# Altium project Q42-PMP.PrjPCB (part 4 of 4)

## Sheet CONNECTIVITY.SchDoc
size A3; DocumentNumber: 1; SheetNumber: 2; SheetTotal: 2
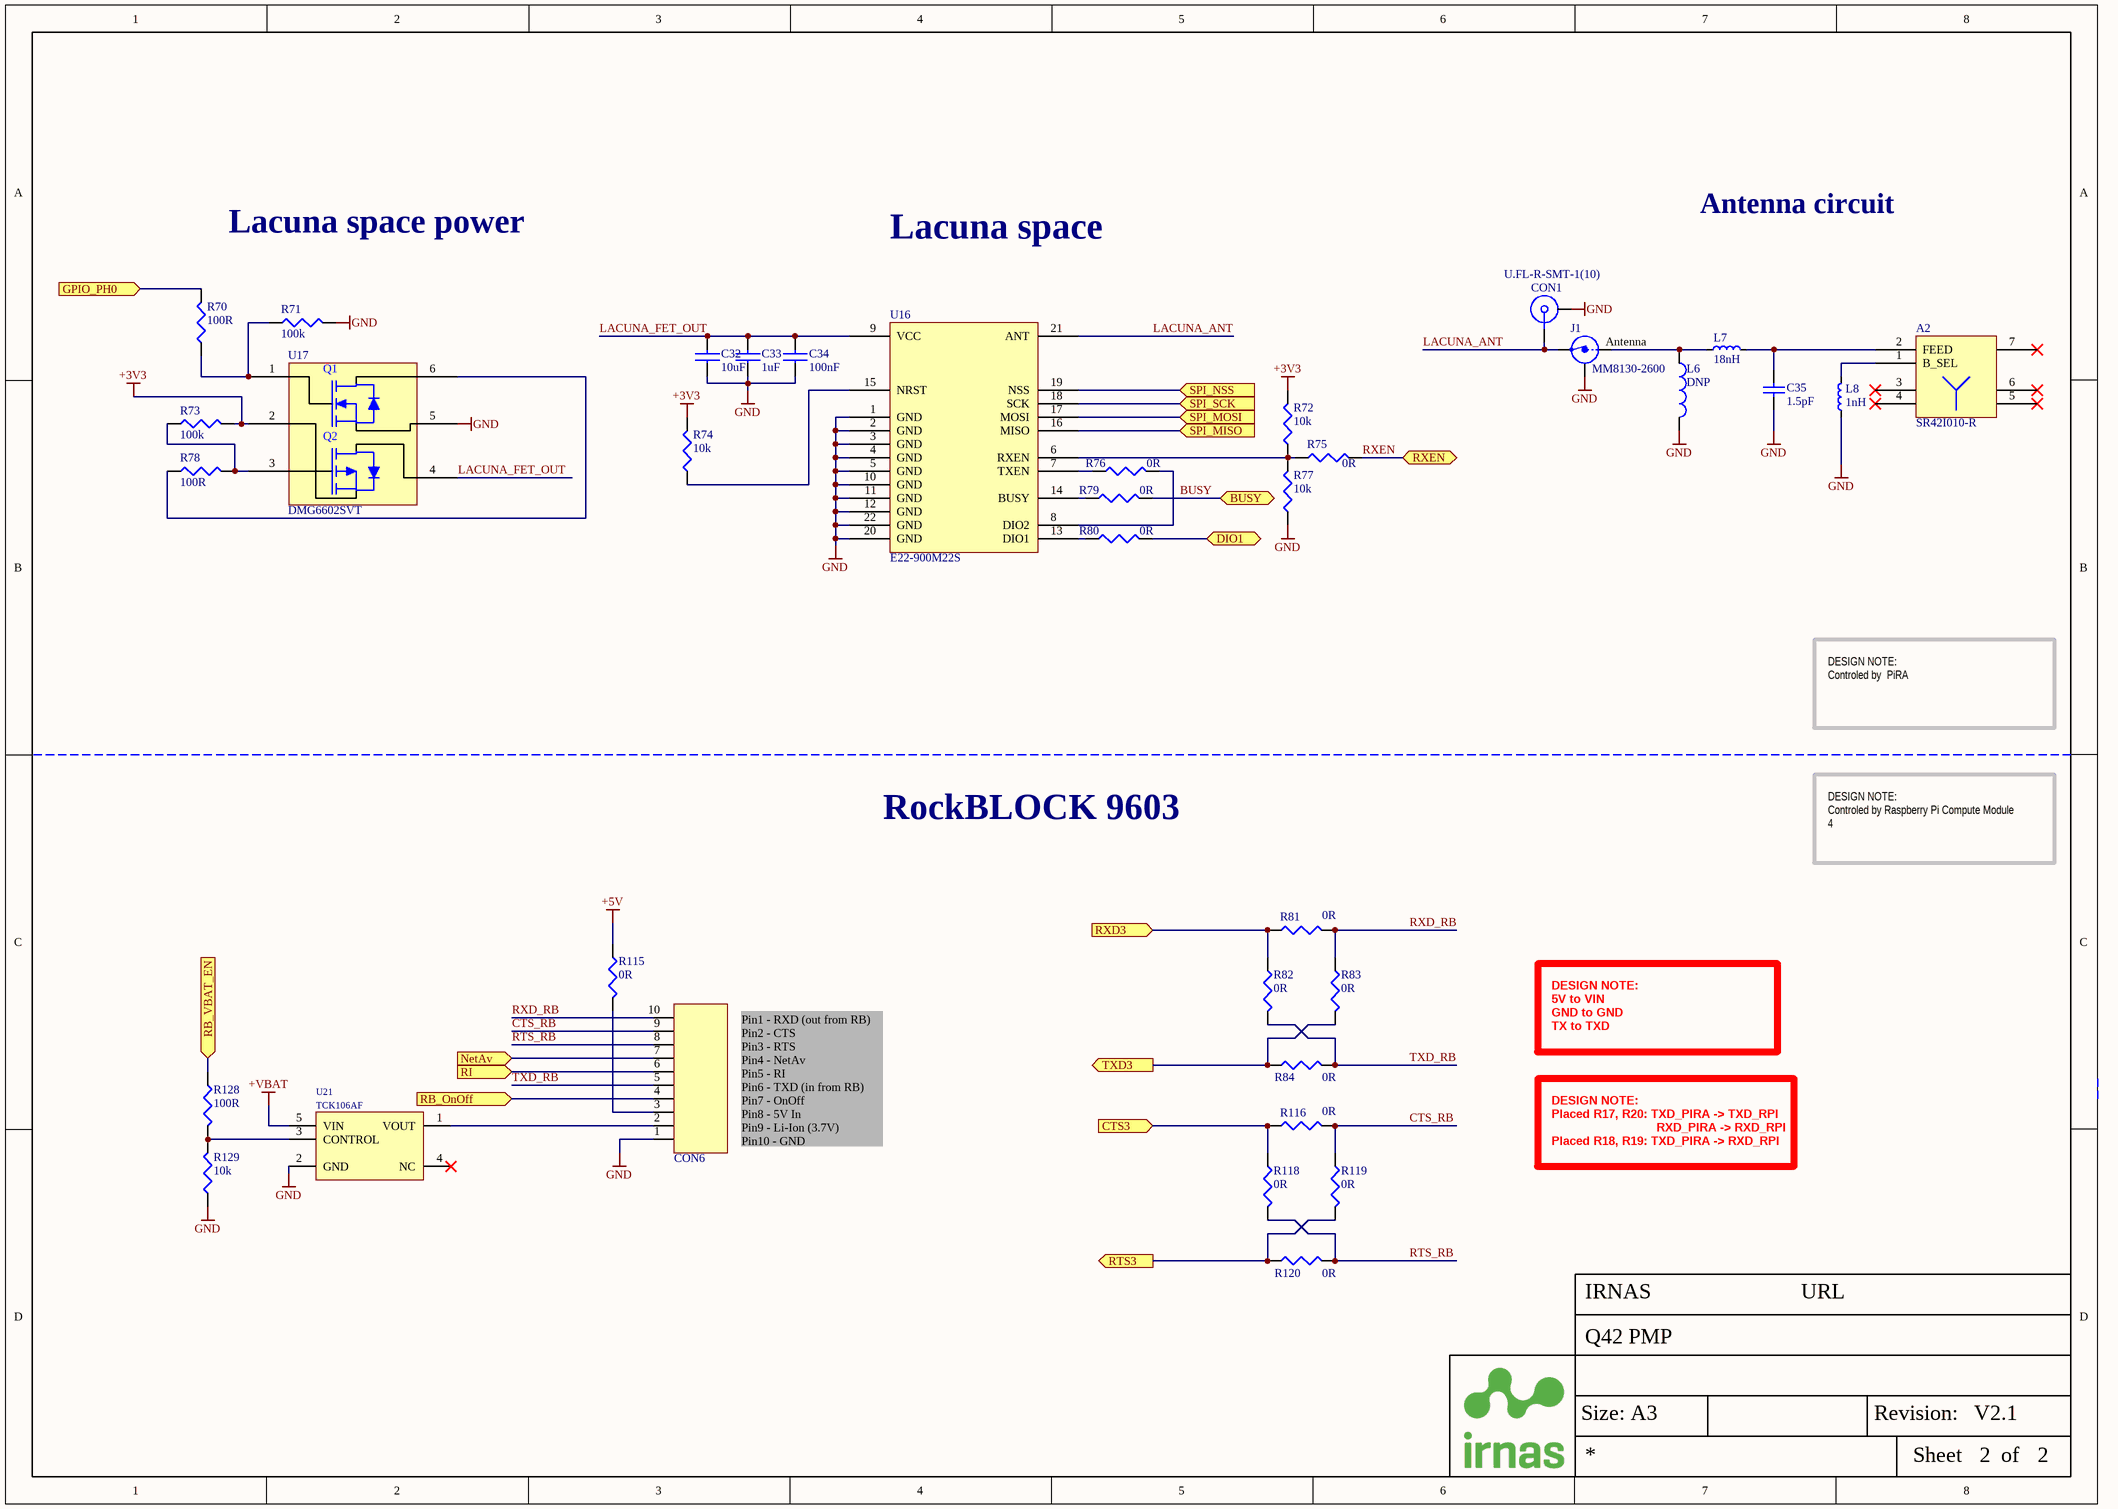
[diagram p6: CONNECTIVITY.SchDoc]

### Parts
A2  SR42I010-R  [LORA_PCB_ANTENNA]
C32  10uF  [CAP0603]
C33  1uF  [CAP0603]
C34  100nF  [CAP0603]
C35  value 1.5pF  [CAP0402]  (hidden comment: 1.5pF/50V/0402)
CON1  U.FL-R-SMT-1(10)  [ufl connector smd]
CON6  53261-1071  [PICOBLADE 10PIN]  (value not drawn)
J1  MM8130-2600  [COAXIAL-SWF]
L6  DNP  [IND0402]
L7  value 18nH  [IND0402]  (hidden comment: 18nH/0402)
L8  1nH  [IND0402]
R70  100R  [RES0603]
R71  100k  [RES0603]
R72  10k  [RES0603]
R73  100k  [RES0603]
R74  10k  [RES0603]
R75  0R  [RES0603]
R76  0R  [RES0603]
R77  10k  [RES0603]
R78  100R  [RES0603]
R79  0R  [RES0603]
R80  0R  [RES0603]
R81  0R  [RES0603]
R82  0R  [RES0603]
R83  0R  [RES0603]
R84  0R  [RES0603]
R115  0R  [RES0603]
R116  0R  [RES0603]
R118  0R  [RES0603]
R119  0R  [RES0603]
R120  0R  [RES0603]
R128  100R  [RES0603]
R129  10k  [RES0603]
U16  E22-900M22S  [E22-900M22S]
U17  DMG6602SVT  [TSOT26]
U21  TCK106AF  [SOT-25]

### Ports
BUSY (bidir), CTS3 (in), DIO1 (bidir), GPIO_PH0 (in), NetAv (in), RB_OnOff (in), RB_VBAT_EN (in), RI (in), RTS3 (out), RXD3 (in), RXEN (bidir), SPI_MISO (in), SPI_MOSI (in), SPI_NSS (in), SPI_SCK (in), TXD3 (out)

### Nets
+3V3: R72.2 R73.2 R74.2 U17.2(S2)
+5V: R115.1
+VBAT: U21.5(VIN)
GND: C32.1 C33.1 C34.1 C35.1 CON1.2 CON6.1 J1.2(Shield) L6.1 L8.1 R71.2 R77.1 R129.1 U16.1(GND) U16.2(GND) U16.3(GND) U16.4(GND) U16.5(GND) U16.10(GND) U16.11(GND) U16.12(GND) U16.20(GND) U16.22(GND) U17.5(S1) U21.2(GND)
BUSY: R79.2 ; port BUSY
CTS3: R116.1 R118.1 ; port CTS3
CTS_RB: CON6.9 R116.2 R119.1
DIO1: R80.2 ; port DIO1
GPIO_PH0: R70.2 ; port GPIO_PH0
LACUNA_ANT: CON1.1 J1.3(OUT) U16.21(ANT)
LACUNA_FET_OUT: C32.2 C33.2 C34.2 U16.9(VCC) U17.4(D2)
NetAv: CON6.7 ; port NetAv
RB_OnOff: CON6.4 ; port RB_OnOff
RB_VBAT_EN: R128.1 ; port RB_VBAT_EN
RI: CON6.6 ; port RI
RTS3: R119.2 R120.1 ; port RTS3
RTS_RB: CON6.8 R118.2 R120.2
RXD3: R81.1 R82.1 ; port RXD3
RXD_RB: CON6.10 R81.2 R83.1
RXEN: R75.2 ; port RXEN
SPI_MISO: U16.16(MISO) ; port SPI_MISO
SPI_MOSI: U16.17(MOSI) ; port SPI_MOSI
SPI_NSS: U16.19(NSS) ; port SPI_NSS
SPI_SCK: U16.18(SCK) ; port SPI_SCK
TXD3: R83.2 R84.1 ; port TXD3
TXD_RB: CON6.5 R82.2 R84.2
NetA2_1: A2.1(B_SEL) L8.2
NetA2_2: A2.2(FEED) C35.2 L7.2
NetCON6_2: CON6.2 U21.1(VOUT)
NetCON6_3: CON6.3 R115.2
NetJ1_1: J1.1(IN) L6.2 L7.1
NetR70_1: R70.1 R71.1 U17.1(G1)
NetR72_1: R72.1 R75.1 R77.2 U16.6(RXEN)
NetR73_1: R73.1 R78.2 U17.3(G2)
NetR74_1: R74.1 U16.15(NRST)
NetR76_1: R76.1 U16.7(TXEN)
NetR76_2: R76.2 U16.8(DIO2)
NetR78_1: R78.1 U17.6(D1)
NetR79_1: R79.1 U16.14(BUSY)
NetR80_1: R80.1 U16.13(DIO1)
NetR128_2: R128.2 R129.2 U21.3(CONTROL)

Not connected (* = marked no-connect by the designer): A2 3* 4* 5* 6* 7*; U21 4(NC)*

### Notes on the sheet
- Lacuna space power
- Lacuna space
- Antenna circuit
- DESIGN NOTE:
  Controled by  PiRA
- RockBLOCK 9603
- DESIGN NOTE:
  Controled by Raspberry Pi Compute Module 4
- DESIGN NOTE:
  5V to VIN
  GND to GND
  TX to TXD
  RX to RXD
- Pin1 - RXD (out from RB)
  Pin2 - CTS
  Pin3 - RTS
  Pin4 - NetAv
  Pin5 - RI
  Pin6 - TXD (in from RB)
  Pin7 - OnOff
  Pin8 - 5V In
  Pin9 - Li-Ion (3.7V)
  Pin10 - GND
- DESIGN NOTE:
  Placed R17, R20: TXD_PIRA -> TXD_RPI
  RXD_PIRA -> RXD_RPI
  Placed R18, R19: TXD_PIRA -> RXD_RPI
  RXD_PIRA -> TXD_RPI
- Size: A3
- Revision:
- Sheet
- of
- (in symbol Coaxial-Internal-SW) Antenna
- (in symbol T_M - DMG6602SVT) Q1; Q2

### Library data of the parts
A2 = ANT - SR42I010-L: Antenna SMD -4dBi Gain 870MHz/928MHz Automotive 7-Pin SMD T/R; Manufacturer: Antenova; Manufacturer Part Number: SR42I010-R; Stock 1: 3154; Pricing 1: 1 = 2.36000, 10 = 1.90000, 50 = 1.90000, 100 = 1.52000, 1000 = 1.07000, 10000 = 0.95900 (USD); Supplier 1: Mouser; Supplier Part Number 1: 237-SR42I010-L
C32 = C - 10uF/10V: Cap Ceramic 10uF 10V X5R 10% SMD 0603 85C Paper T/R; Manufacturer: Samsung; Manufacturer Part Number: CL10A106KP8NNNC; IRNAS Part No.: /; Supplier 1: Digi-Key; Stock 1: 2844657; Pricing 1: 1=0.36, 10=0.248, 100=0.1403, 500=0.099, 1000=0.08663 (USD); Mount: Surface Mount; Case/Package: 0603; Case Code (Metric): 1608; Case Code (Imperial): 0603; Material: Ceramic; Contact Plating: Tin; Min Operating Temperature: -55°C; Max Operating Temperature: 85°C; Capacitance: 10uF; Tolerance: 10%; Package Quantity: 1; Packaging: Tape and Reel; Voltage Rating: 10V; Dielectric: X5R; Voltage Rating (DC): 10V; Length: 1.6mm; Height: 0.8mm; Width: 0.031inch; Thickness: 0.035inch; Depth: 0.8mm; Radiation Hardening: No; Lead Free: Lead Free; ComponentLink1URL: https://www.verical.com/server-webapp/html/getDatasheet?partID=359551; ComponentLink1Description: https://www.verical.com/server-webapp/html/getDatasheet?partID=359551; ComponentLink2URL: http://www1.futureelectronics.com/doc/SAMSUNG%20PASSIVE/CL05B104KQ5NNNC.pdf; ComponentLink2Description: http://www1.futureelectronics.com/doc/SAMSUNG%20PASSIVE/CL05B104KQ5NNNC.pdf; ComponentLink3URL: https://produktinfo.conrad.com/datenblaetter/450000-474999/457369-da-01-en-VS_KONDENSATOR_0603.pdf; ComponentLink3Description: https://produktinfo.conrad.com/datenblaetter/450000-474999/457369-da-01-en-VS_KONDENSATOR_0603.pdf; Supplier Part Number 1: 1276-1192-1-ND
C33 = C - 1uF: as C26 on sheet PIRA BLE, LORA, RTC; Supplier 1: Farnell; Manufacturer: MURATA; Manufacturer Part Number: GRM188R61H105KAALD; RoHS: YES; Stock 1: 62682; Pricing 1: 10=0.093, 100=0.062, 500=0.0507, 1000=0.0465, 2000=0.0429, 4000=0.0399, 20000=0.0372, 40000=0.0365 (GBP); Packaging: Cut Tape; Operating Temperature Min: -55; Operating Temperature Max: 85; Automotive Qualification Standard: -; MSL: -; Capacitance Tolerance ±: ± 10%; ComponentLink1URL: http://www.farnell.com/datasheets/2048611.pdf; ComponentLink1Description: http://www.farnell.com/datasheets/2048611.pdf; Supplier Part Number 1: 1845736
C34 = C - 100nF: as C28 on sheet USB SWITCH; Supplier 1: Farnell; Manufacturer: MURATA; Manufacturer Part Number: GRM188R71C104KA01J; RoHS: YES; Stock 1: 18297; Pricing 1: 10=0.0145, 100=0.0126, 500=0.0081, 2500=0.0059, 5000=0.0052, 10000=0.0046, 50000=0.0036, 100000=0.0035 (GBP); Packaging: Cut Tape; Operating Temperature Min: -55; Operating Temperature Max: 125; Automotive Qualification Standard: -; MSL: MSL 1 - Unlimited; ComponentLink1URL: http://www.farnell.com/datasheets/2189124.pdf; ComponentLink1Description: http://www.farnell.com/datasheets/2189124.pdf; Supplier Part Number 1: 2688519
C35 = C - 1.5pF/50V/0402: CAP CER 1.5PF 50V C0G/NP0 0402; Published: 8-Jun-2000; LatestRevisionDate: 05-oct-2007  -  Semtech; LatestRevisionNote: Re-released for DXP Platform.; Publisher: Altium Limited; Supplier 1: Digi-Key; Supplier Part Number 1: 490-6212-1-ND
CON1 = U.FL-R-SMT-1(10): RF / Coaxial Connector, U.FL Coaxial, Straight Jack, Surface Mount Vertical, 50 ohm, Brass; Manufacturer: Hirose; Featured Product: U.FL Series Connectors; Connector Style: U.FL, Ultra Miniature Coaxial; Connector Type: Receptacle, Male Pin; Contact Termination: Solder; Impedance: 50 Ohm; Frequency - Max: 6GHz; Body Material: Phosphor Bronze; Body Finish: Silver; Center Contact Plating: Gold; Dielectric Material: Liquid Crystal Polymer (LCP); Online Catalog: UMCC (Ultra Miniature Coax Connectors), U.FL Series; Other Names: H11891TR  Q5400621  U.FL-R-SMT-1 10  U.FL-R-SMT-1(10)-ND  UFLRSMT110; Supplier 1: Farnell; Manufacturer Part Number: U.FL-R-SMT-1(10); Stock 1: 0; Standard Package: 2,500; Category: Connectors, Interconnects; Family: Coaxial Connectors (RF); Series: U.FL; Packaging: Tape & Reel (TR); Shield Termination: Solder; Mounting Type: Surface Mount; Cable Group: -; Fastening Type: Snap-On; Features: -; Housing Color: Beige; Ingress Protection: -; Center Contact Material: Brass; Voltage Rating: -; Operating Temperature: -40°C ~ 90°C; ComponentLink1URL: http://www.farnell.com/datasheets/91524.pdf; ComponentLink1Description: http://www.farnell.com/datasheets/91524.pdf; ComponentLink2URL: http://uk.rs-online.com/webdocs/1363/0900766b81363563.pdf; ComponentLink2Description: http://uk.rs-online.com/webdocs/1363/0900766b81363563.pdf; ComponentLink3URL: http://www.farnell.com/datasheets/1947917.pdf; ComponentLink3Description: http://www.farnell.com/datasheets/1947917.pdf; Supplier Part Number 1: 1688077
CON6 = PicoBlade 10pin: Wire-To-Board Connector, Right Angle, 1.25 mm, 10 Contacts, Header, PicoBlade 53261 Series; ComponentLink1Description: Datasheet; ComponentLink1URL: http://www.farnell.com/datasheets/2697773.pdf?_ga=2.235245378.2144023421.1568612611-1741076818.1563951383; Supplier 1: Farnell; Supplier Part Number 1: 1125377
J1 = Coaxial-Internal-SW: Coaxial Connector with Switch; Manufacturer: Murata; 2nd source part number: 81-MM8130-2600RA2; Artikkelnr Noca: 55029011; Artikkelnr Simpro: N.A.; Part Number: MM8130-2600; Manufacturer Part Number: MM8130-2600; Datasheet: http://www.murata.com/products/catalog/pdf/o33e.pdf; LatestRevisionDate: 2014-04-24; Pin Count: 3; Publisher: Nordic Semiconductor; Published: 2014-04-24; Value: MM8130-2600; Note: *; Supplier: Digi-Key; Supplier part number: 490-4981-1-ND; 2nd source Supplier: Mouser; Footprint Doc: COAXIAL-SWF
L6 = L - 4.3nH/0402: Inductor RF Chip Multi-Layer 4.3nH 0.3nH 100MHz 8Q-Factor Air 300mA 210mOhm DCR 0402 Paper T/R; Manufacturer: Murata; Manufacturer Part Number: LQG15HN4N3S02D; IRNAS Part No.: /; Q Factor: 8; Self Resonant Frequency: 6GHz; Shielding: Unshielded; DC Resistance (DCR): 210mR; Supplier 1: Digi-Key; Stock 1: 3502; Pricing 1: 1 = 0.10000, 10 = 0.06100, 100 = 0.04040, 500 = 0.03366, 1000 = 0.02827, 2500 = 0.02423 (USD); RoHS: Yes; Mount: Surface Mount; Case/Package: 0402; Core Material: Air; Case Code (Metric): 1005; Case Code (Imperial): 0402; Min Operating Temperature: -55°C; Max Operating Temperature: 125°C; Package Quantity: 10000; Packaging: Tape and Reel; Current Rating: 300mA; Inductance: 4.3nh; Test Frequency: 100MHz; Max DC Current: 300mA; Termination: SMD/SMT; Current: 300mA; DC Current: 300mA; Military Standard: Not; Length: 1.05mm; Height: 0.5mm; Width: 0.02inch; Height - Seated (Max): 0.022inch; Depth: 0.55mm; Radiation Hardening: No; REACH SVHC: No SVHC; Lead Free: Lead Free; ComponentLink1URL: http://uk.rs-online.com/webdocs/0f10/0900766b80f10808.pdf?src-supplier=RSComponents; ComponentLink1Description: http://uk.rs-online.com/webdocs/0f10/0900766b80f10808.pdf?src-supplier=RSComponents; ComponentLink2URL: http://search.murata.co.jp/Ceramy/image/img/PDF/ENG/L0075S0083LQG15HN.pdf?src-supplier=Avnet; ComponentLink2Description: http://search.murata.co.jp/Ceramy/image/img/PDF/ENG/L0075S0083LQG15HN.pdf?src-supplier=Avnet; ComponentLink3URL: http://www.farnell.com/datasheets/66026.pdf?src-supplier=Element14; ComponentLink3Description: http://www.farnell.com/datasheets/66026.pdf?src-supplier=Element14; ComponentLink4URL: https://www.verical.com/server-webapp/html/getDatasheet?partID=31252&src-supplier=Verical; ComponentLink4Description: https://www.verical.com/server-webapp/html/getDatasheet?partID=31252&src-supplier=Verical; ComponentLink5URL: http://search.murata.co.jp/Ceramy/image/img/PDF/ENG/L0075S0083LQG15HN.pdf?src-supplier=Avnet+Europe; ComponentLink5Description: http://search.murata.co.jp/Ceramy/image/img/PDF/ENG/L0075S0083LQG15HN.pdf?src-supplier=Avnet+Europe; ComponentLink6URL: https://search.murata.co.jp/Ceramy/image/img/P02/partnumberingAT_LQ3E.pdf?src-supplier=Digi-Key; ComponentLink6Description: https://search.murata.co.jp/Ceramy/image/img/P02/partnumberingAT_LQ3E.pdf?src-supplier=Digi-Key; Supplier Part Number 1: 490-6563-1-ND
L7 = L - 18nH/230mA/0402: 18 nH, 0.8 ohm, 2.3 GHz, 260 mA, 0402; Manufacturer: MURATA; Manufacturer Part Number: LQG15WH18NJ02D; Code_IEC: 1005; Published: 8-Jun-2000; LatestRevisionDate: 05-oct-2007  -  Semtech; LatestRevisionNote: Re-released for DXP Platform.; Publisher: Altium Limited; Code_JEITA: 0402; Supplier 1: Farnell; Supplier Part Number 1: 3263541
L8 = L - 1nH/0402: Multilayer Inductor, 1 nH, 0.07 ohm, 10 GHz, 1 A, 0402 [1005 Metric], LQG15HS_02 Series; Supplier 1: Farnell; Supplier Part Number 1: 3471230
R70 R78 R128 = R - 100R: as R25 on sheet PIRA BLE, LORA, RTC; Supplier 1: Farnell; Manufacturer: MULTICOMP; Manufacturer Part Number: MC0063W06031100R; RoHS: Y-EX; Stock 1: 78152; Pricing 1: 10=0.0011, 100=0.001, 500=0.0009, 1000=0.0008, 2500=0.0007 (GBP); Resistance Tolerance: ± 1%; Packaging: Cut Tape; Resistor Element Material: Thick Film; Automotive Qualification Standard: -; Operating Temperature Max: 155; Operating Temperature Min: -55; Operating Temperature Range: -55°C to +155; Tape Width: 8; Temperature Coeff. -: 200; Tolerance +: 1%; Tolerance -: 1%; ComponentLink1URL: http://www.farnell.com/datasheets/1788326.pdf; ComponentLink1Description: http://www.farnell.com/datasheets/1788326.pdf; ComponentLink2URL: http://www.farnell.com/cad/1561149.zip; ComponentLink2Description: http://www.farnell.com/cad/1561149.zip; ComponentLink3URL: http://www.farnell.com/datasheets/2289252.pdf; ComponentLink3Description: http://www.farnell.com/datasheets/2289252.pdf; Supplier Part Number 1: 9330364
R71 R73 = R - 100k: MULTICOMP - MCMR06X104 JTL - RES, CERAMIC, 100K, 5%, 0.1W, 0603; IRNAS Part No.: I-100007; Resistance: 100; Voltage Rating: 75; Resistor Case Style: 0603 [1608 Metric]; Product Range: MCMR Series; Temperature Coefficient: ± 100; Resistor Mounting: Surface Mount Device<!--FANDB--><div class="features-and-benefits-container"><div class="features-and-benefits-description"><span class="features-benefits-value">The Multicomp MCMR series resistors are automotive grade, anti sulphured thick film chip resistor. The resistance range includes E24 and E96 decade values from 1ohm to 10Mohm. These resistors are constructed on top of a high grade ceramic body.</span></div><div class="features-and-benefits-list"><ul class="features-and-benefits-list-list"><li class="features-and-benefits-list-item">EIA 0402, 0603, 0805, 1206 chip sizes available</li><li class="features-and-benefits-list-item">High reliability and stability</li><li class="features-and-benefits-list-item">Automotive grade AEC-Q200 compliant</li><li class="features-and-benefits-list-item">Complaint with (IEC 60068-1) 55/155/56 climatic category</li><li class="features-and-benefits-list-item">Maximum operation voltage of 50V, 75V, 150V and 200V</li><li class="features-and-benefits-list-item">Power rating of 62.5mW, 100mW, 125mW and 250mW</li><li class="features-and-benefits-list-item">Available in ±1% and ±5% tolerance</li><li class="features-and-benefits-list-item">Temperature coefficient (TCR) of +200ppm/°C, +100ppm/°C and -200ppm/°C to +400ppm/°C</li><li class="features-and-benefits-list-item">Operating temperature range -55°C to 155; Supplier 1: Farnell; Manufacturer: MULTICOMP; Manufacturer Part Number: MCMR06X104 JTL; RoHS: Y-EX; Stock 1: 187; Pricing 1: 10=0.0109, 100=0.0085, 500=0.006, 1000=0.0048, 2500=0.004, 5000=0.003, 25000=0.002, 50000=0.0016 (GBP); Power Rating: 100; Resistance Tolerance: ± 5%; Packaging: Cut Tape; Resistor Element Material: Ceramic; Automotive Qualification Standard: -; ComponentLink1URL: http://www.farnell.com/datasheets/1716707.pdf; ComponentLink1Description: http://www.farnell.com/datasheets/1716707.pdf; Supplier Part Number 1: 2073357
R72 R74 R77 R129 = R - 10k: as R30 on sheet PIRA BLE, LORA, RTC; Supplier 1: Farnell; Manufacturer: MULTICOMP; Manufacturer Part Number: MCMR06X103 JTL; RoHS: Y-EX; Stock 1: 19791; Pricing 1: 10=0.0087, 100=0.0074, 500=0.0061, 1000=0.0048, 2500=0.0032, 5000=0.0024, 25000=0.0016, 50000=0.0013 (GBP); Resistance Tolerance: ± 5%; Packaging: Cut Tape; Resistor Element Material: Ceramic; ComponentLink1URL: http://www.farnell.com/datasheets/1716707.pdf; ComponentLink1Description: http://www.farnell.com/datasheets/1716707.pdf; Supplier Part Number 1: 2073356
R75 R76 R79-R84 R115 R116 R118-R120 = R - 0R: as R117 on sheet USB SWITCH; Supplier 1: Farnell; Manufacturer: BOURNS; Manufacturer Part Number: CR0603-J/-000ELF; RoHS: YES; Stock 1: 58200; Pricing 1: 10=0.0146, 250=0.0097, 1000=0.0073, 5000=0.0049, 12500=0.0042 (GBP); Resistance Tolerance: ± 5%; Packaging: Cut Tape; Resistor Element Material: Thick Film; Temperature Coefficient: -; Automotive Qualification Standard: -; MSL: MSL 1 - Unlimited; ComponentLink1URL: http://www.bourns.com/engineering/CHPREZTR/cr0603.stp; ComponentLink1Description: http://www.bourns.com/engineering/CHPREZTR/cr0603.stp; ComponentLink2URL: http://www.farnell.com/datasheets/2178762.pdf; ComponentLink2Description: http://www.farnell.com/datasheets/2178762.pdf; Supplier Part Number 1: 2008343
U16 = RF - E22-900M22S: ComponentLink1Description: Datasheet; ComponentLink1URL: http://www.ebyte.com/en/downpdf.aspx?id=437
U17 = T_M - DMG6602SVT: Dual MOSFET, N and P Channel, 3.4 A, 30 V, 0.038 ohm, 10 V, 1 V; ComponentLink1Description: Datasheet; ComponentLink1URL: http://www.farnell.com/datasheets/1915929.pdf?_ga=2.95290844.1984085946.1565589483-1741076818.1563951383; Supplier 1: Farnell; Supplier Part Number 1: 2061522
U21 = SW - TCK106AF: 1.0 A Load Switch IC; Opis / Description: TCK106AF; Value: TCK106AF; Supplier 1: Digi-Key; Supplier Part Number 1: TCK106AFLFCT-ND

## Sheet IFREMER ADD ON.SchDoc
size A3; DocumentNumber: 1; SheetNumber: 2; SheetTotal: 2
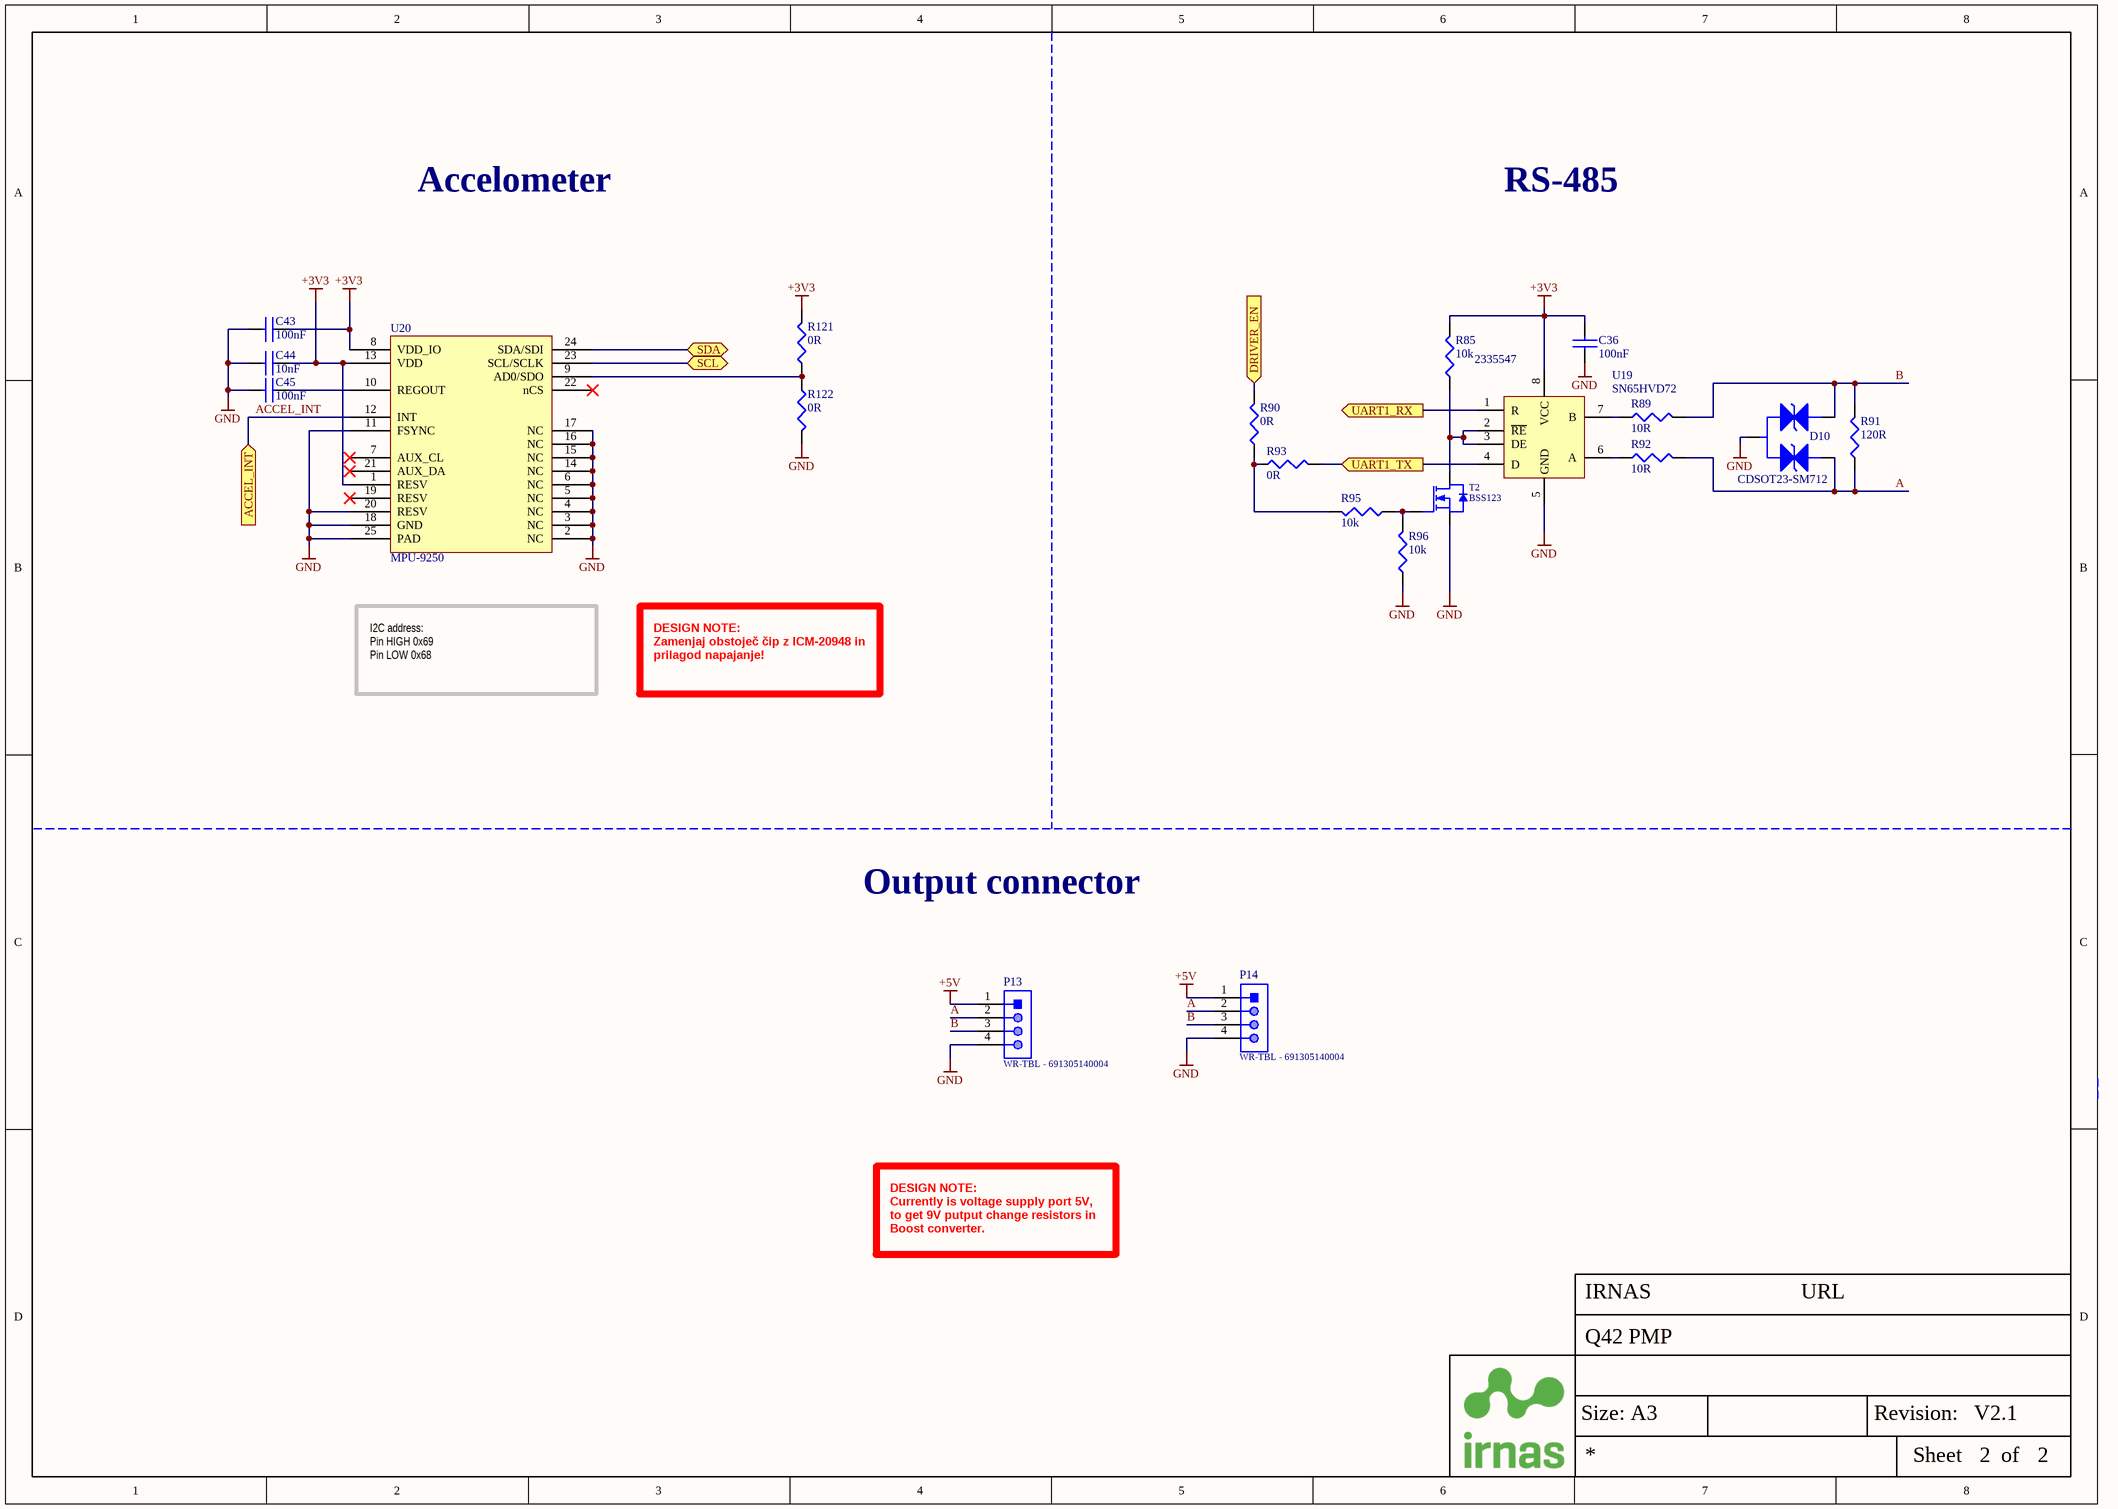
[diagram p7: IFREMER ADD ON.SchDoc]

### Parts
C36  100nF  [CAP0603]
C43  100nF  [CAP0603]
C44  10nF  [CAP0603]
C45  100nF  [CAP0603]
D10  CDSOT23-SM712  [SOT23-3AL]
P13  WR-TBL - 691305140004  [691305140004]
P14  WR-TBL - 691305140004  [691305140004]
R85  10k  [RES0603]
R89  10R  [RES0603]
R90  0R  [RES0603]
R91  120R  [RES0603]
R92  10R  [RES0603]
R93  0R  [RES0603]
R95  10k  [RES0603]
R96  10k  [RES0603]
R121  0R  [RES0603]
R122  0R  [RES0603]
T2  BSS123  [SOT23-3AL]
U19  SN65HVD72  Supplier Part Number 1: 2335547  [SOIC-8 REFLOW]
U20  MPU-9250  [QFN40P300X300X105_HS-25N]

### Ports
ACCEL_INT (in), DRIVER_EN (in), SCL (bidir), SDA (bidir), UART1_RX (out), UART1_TX (in)

### Nets
+3V3: C36.2 C43.1 C44.1 R85.2 R121.2 U19.8(VCC) U20.1(RESV) U20.8(VDD_IO) U20.13(VDD)
+5V: P13.1 P14.1
GND: C36.1 C43.2 C44.2 C45.2 D10.3(ANODE) P13.4 P14.4 R96.1 R122.2 T2.2(S) U19.5(GND) U20.2(NC) U20.3(NC) U20.4(NC) U20.5(NC) U20.6(NC) U20.11(FSYNC) U20.14(NC) U20.15(NC) U20.16(NC) U20.17(NC) U20.18(GND) U20.20(RESV) U20.25(PAD)
A: D10.2(cathode) P13.2 P14.2 R91.1 R92.2
ACCEL_INT: U20.12(INT) ; port ACCEL_INT
B: D10.1(cathode) P13.3 P14.3 R89.2 R91.2
DRIVER_EN: R90.2 ; port DRIVER_EN
GPS_RX: R93.2 U19.4(D) ; port UART1_TX
GPS_TX: U19.1(R) ; port UART1_RX
SCL: U20.23(SCL/SCLK) ; port SCL
SDA: U20.24(SDA/SDI) ; port SDA
NetC45_1: C45.1 U20.10(REGOUT)
NetR85_1: R85.1 T2.3(D) U19.2(~{RE}) U19.3(DE)
NetR89_1: R89.1 U19.7(B)
NetR90_1: R90.1 R93.1 R95.2
NetR92_1: R92.1 U19.6(A)
NetR95_1: R95.1 R96.2 T2.1(G)
NetR121_1: R121.1 R122.1 U20.9(AD0/SDO)

Not connected (* = marked no-connect by the designer): U20 7(AUX_CL)* 19(RESV)* 21(AUX_DA)* 22(nCS)*

### Notes on the sheet
- Accelometer
- RS-485
- I2C address:
  Pin HIGH 0x69
  Pin LOW 0x68
- DESIGN NOTE:
  Zamenjaj obstoječ čip z ICM-20948 in prilagod napajanje!
- Output connector
- DESIGN NOTE:
  Currently is voltage supply port 5V, to get 9V putput change resistors in Boost converter.
- Size: A3
- Revision:
- Sheet
- of

### Library data of the parts
C36 C43 C45 = C - 100nF: as C28 on sheet USB SWITCH; Supplier 1: Farnell; Manufacturer: MURATA; Manufacturer Part Number: GRM188R71C104KA01J; RoHS: YES; Stock 1: 18297; Pricing 1: 10=0.0145, 100=0.0126, 500=0.0081, 2500=0.0059, 5000=0.0052, 10000=0.0046, 50000=0.0036, 100000=0.0035 (GBP); Packaging: Cut Tape; Operating Temperature Min: -55; Operating Temperature Max: 125; Automotive Qualification Standard: -; MSL: MSL 1 - Unlimited; ComponentLink1URL: http://www.farnell.com/datasheets/2189124.pdf; ComponentLink1Description: http://www.farnell.com/datasheets/2189124.pdf; Supplier Part Number 1: 2688519
C44 = C - 10nF: KEMET - C0603X103K5RECAUTO - CAP, MLCC, AEC-Q200, X7R, 0.01UF, 50V; Manufacturer: TDK EPCOS; IRNAS Part No.: I-200004; Supplier 1: Farnell; Manufacturer Part Number: C0603X103K5RECAUTO; Stock 1: 307350; Pricing 1: 10=0.133, 100=0.0731, 500=0.055, 1000=0.0465, 2000=0.0408, 4000=0.0336, 20000=0.0295 (GBP); ComponentLink1URL: http://www.farnell.com/datasheets/2290180.pdf; ComponentLink1Description: http://www.farnell.com/datasheets/2290180.pdf; Supplier Part Number 1: 2760492
D10 = D_TVS - CDSOT23-SM712: TVS Diode, CDSOT23 Series, Bidirectional, 12 V, 26 V, SOT-23, 3 Pins; Manufacturer: DIODES INC.; Manufacturer Part Number: 1N4148W-7-F.; Diode Configuration: Single; Repetitive Reverse Voltage Vrrm Max: 100; Forward Current If(AV): 300; Forward Voltage VF Max: 1.25; Reverse Recovery Time trr Max: 4; Forward Surge Current Ifsm Max: 2; Diode Case Style: SOD-123; Product Range: 1N4148 Series; SVHC: No SVHC (17-Dec-2015); Diode Type: Switching; Supplier 1: Farnell; RoHS: YES; Stock 1: 157320; Pricing 1: 1=0.136, 25=0.132, 100=0.0465, 500=0.042, 1000=0.024, 3000=0.021, 9000=0.017, 30000=0.0149 (GBP); Operating Temperature Max: 150; No. of Pins: 2; Packaging: Cut Tape; Automotive Qualification Standard: -; MSL: MSL 1 - Unlimited; Operating Temperature Min: -65; Operating Temperature Range: -65°C to +150°C<!--FANDB--><div class="features-and-benefits-container"><div class="features-and-benefits-description"><span class="features-benefits-value">The 1N4148W-7-F is a surface mount fast Switching Diode with moulded plastic case. Suitable for general purpose switching applications.</span></div><div class="features-and-benefits-list"><ul class="features-and-benefits-list-list"><li class="features-and-benefits-list-item">Fast Switching Speed</li><li class="features-and-benefits-list-item">2; ComponentLink1URL: http://www.farnell.com/datasheets/2238378.pdf; ComponentLink1Description: http://www.farnell.com/datasheets/2238378.pdf; Supplier Part Number 1: 1776392
P13 P14 = WR-TBL - 691305140004: Serie 3051 - 3.50mm Horizontal PCB Header with Plastic Latch WR-TBL, 4 pin; Pin Number: 4; Gender: Male; ComponentLink1Description: Manufacturer; ComponentLink1URL: http://www.we-online.de; ComponentLink2Description: Datasheet; ComponentLink2URL: http://katalog.we-online.de/em/datasheet/691305140004.pdf; Part Number: 691305140004; Published Date: June 2018; Publisher: Wurth Elektronik; Pitch: 3.50 mm; Operating Temperature: -40 to 105 degC; Mounting Technology: THT; Packaging: Box
R85 R95 R96 = R - 10k: as R30 on sheet PIRA BLE, LORA, RTC; Supplier 1: Farnell; Manufacturer: MULTICOMP; Manufacturer Part Number: MCMR06X103 JTL; RoHS: Y-EX; Stock 1: 19791; Pricing 1: 10=0.0087, 100=0.0074, 500=0.0061, 1000=0.0048, 2500=0.0032, 5000=0.0024, 25000=0.0016, 50000=0.0013 (GBP); Resistance Tolerance: ± 5%; Packaging: Cut Tape; Resistor Element Material: Ceramic; ComponentLink1URL: http://www.farnell.com/datasheets/1716707.pdf; ComponentLink1Description: http://www.farnell.com/datasheets/1716707.pdf; Supplier Part Number 1: 2073356
R89 R92 = R - 10R: as R56 on sheet USB SWITCH; Supplier 1: Farnell; Manufacturer: VISHAY; Manufacturer Part Number: RCA060310R0FKEA; RoHS: YES; Stock 1: 9559; Pricing 1: 10=0.0803, 100=0.0386, 500=0.0235, 2500=0.015, 5000=0.0135, 10000=0.0108, 50000=0.0068, 100000=0.0067 (GBP); Resistance Tolerance: ± 1%; Packaging: Cut Tape; Resistor Element Material: Thick Film; ComponentLink1URL: http://www.farnell.com/datasheets/2111201.pdf; ComponentLink1Description: http://www.farnell.com/datasheets/2111201.pdf; Supplier Part Number 1: 2616585
R90 R93 R121 R122 = R - 0R: as R117 on sheet USB SWITCH; Supplier 1: Farnell; Manufacturer: BOURNS; Manufacturer Part Number: CR0603-J/-000ELF; RoHS: YES; Stock 1: 58200; Pricing 1: 10=0.0146, 250=0.0097, 1000=0.0073, 5000=0.0049, 12500=0.0042 (GBP); Resistance Tolerance: ± 5%; Packaging: Cut Tape; Resistor Element Material: Thick Film; Temperature Coefficient: -; Automotive Qualification Standard: -; MSL: MSL 1 - Unlimited; ComponentLink1URL: http://www.bourns.com/engineering/CHPREZTR/cr0603.stp; ComponentLink1Description: http://www.bourns.com/engineering/CHPREZTR/cr0603.stp; ComponentLink2URL: http://www.farnell.com/datasheets/2178762.pdf; ComponentLink2Description: http://www.farnell.com/datasheets/2178762.pdf; Supplier Part Number 1: 2008343
R91 = R - 120R: RES SMD 120 OHM 1% 1/4W 0603; Manufacturer: Vishay; Manufacturer Part Number: CRCW0603120RFKEAHP; Voltage Rating: 75V; Power Rating: 250mW; Temperature Coefficient: 100ppm/°C; Supplier 1: Farnell; Stock 1: 34760; Pricing 1: 10=0.141, 100=0.0937, 500=0.0669, 1000=0.0453 (EUR); Case/Package: 0603; Contact Plating: Tin; Case Code (Metric): 1608; Case Code (Imperial): 0603; Min Operating Temperature: -55°C; Max Operating Temperature: 155°C; Package Quantity: 5000; Packaging: Tape and Reel; Termination: SMD/SMT; Resistance: 120R; Tolerance: 1%; Composition: Thick Film; Number of Terminations: 2; Military Standard: Not; Max Power Dissipation: 250mW; Features: Automotive AEC-Q200; Length: 1.6mm; Height: 0.022inch; Width: 0.033inch; Depth: 0.85mm; Radiation Hardening: No; REACH SVHC: Unknown; ComponentLink1URL: https://datasheet.ciiva.com/5852/424479-5852064.pdf; ComponentLink1Description: https://datasheet.ciiva.com/5852/424479-5852064.pdf; ComponentLink2URL: https://datasheet.ciiva.com/2578/crcwhpe3-2578529.pdf; ComponentLink2Description: https://datasheet.ciiva.com/2578/crcwhpe3-2578529.pdf; ComponentLink3URL: https://datasheet.ciiva.com/8975/crcwhpe3-8975275.pdf; ComponentLink3Description: https://datasheet.ciiva.com/8975/crcwhpe3-8975275.pdf; ComponentLink4URL: https://datasheet.ciiva.com/7777/424479-7777277.pdf; ComponentLink4Description: https://datasheet.ciiva.com/7777/424479-7777277.pdf; ComponentLink5URL: https://datasheet.ciiva.com/7777/424479-7777278.pdf; ComponentLink5Description: https://datasheet.ciiva.com/7777/424479-7777278.pdf; Supplier Part Number 1: 1738892
T2 = T_M - BSS123: N-Channel Vds = 100V, Id = 170 mA; Opis / Description: MOSFET BSS123       /N-Channel; Komp / Device: SMD; Value: BSS128W; Velikost / Size: SOT23; ComponentLink1Description: Datasheet; ComponentLink1URL: C:\ELRADSVN\Altium_Library\Libraries\Active\Datasheet\BSS138BKW.pdf; Date: 11.07.2018; Supplier 1: Farnell; Supplier Part Number 1: 9845321
U19 = INT - SN65HVD72: Supplier 1: Farnell
U20 = SEN - MPU-9250: IMU ACCEL/GYRO/MAG I2C/SPI 24QFN; Manufacturer: TDK InvenSense; Interface: I2C; Sensor Type: Accelerometer; Max Supply Voltage: 3.6V; Min Supply Voltage: 2.4V; Output Type: SPI; Manufacturer Part Number: MPU-9250; Stock 1: 0; RoHS: Yes; Mount: Surface Mount; Case/Package: QFN; Number of Pins: 24; Min Operating Temperature: -40°C; Max Operating Temperature: 85°C; Package Quantity: 1; Length: 3.1mm; Height: 1mm; Width: 3.1mm; ComponentLink1URL: https://datasheet.ciiva.com/29175/mpu-9250-29175105.pdf?src-supplier=Digi-Key; ComponentLink1Description: https://datasheet.ciiva.com/29175/mpu-9250-29175105.pdf?src-supplier=Digi-Key; Supplier 1: RSComponents; Supplier Part Number 1: 883-7942P; Supplier 2: Mouser; Supplier Part Number 2: 410-MPU-9250

## Sheet RASPBERRY CM4.SchDoc
size A3; DocumentNumber: 1; SheetNumber: 2; SheetTotal: 2
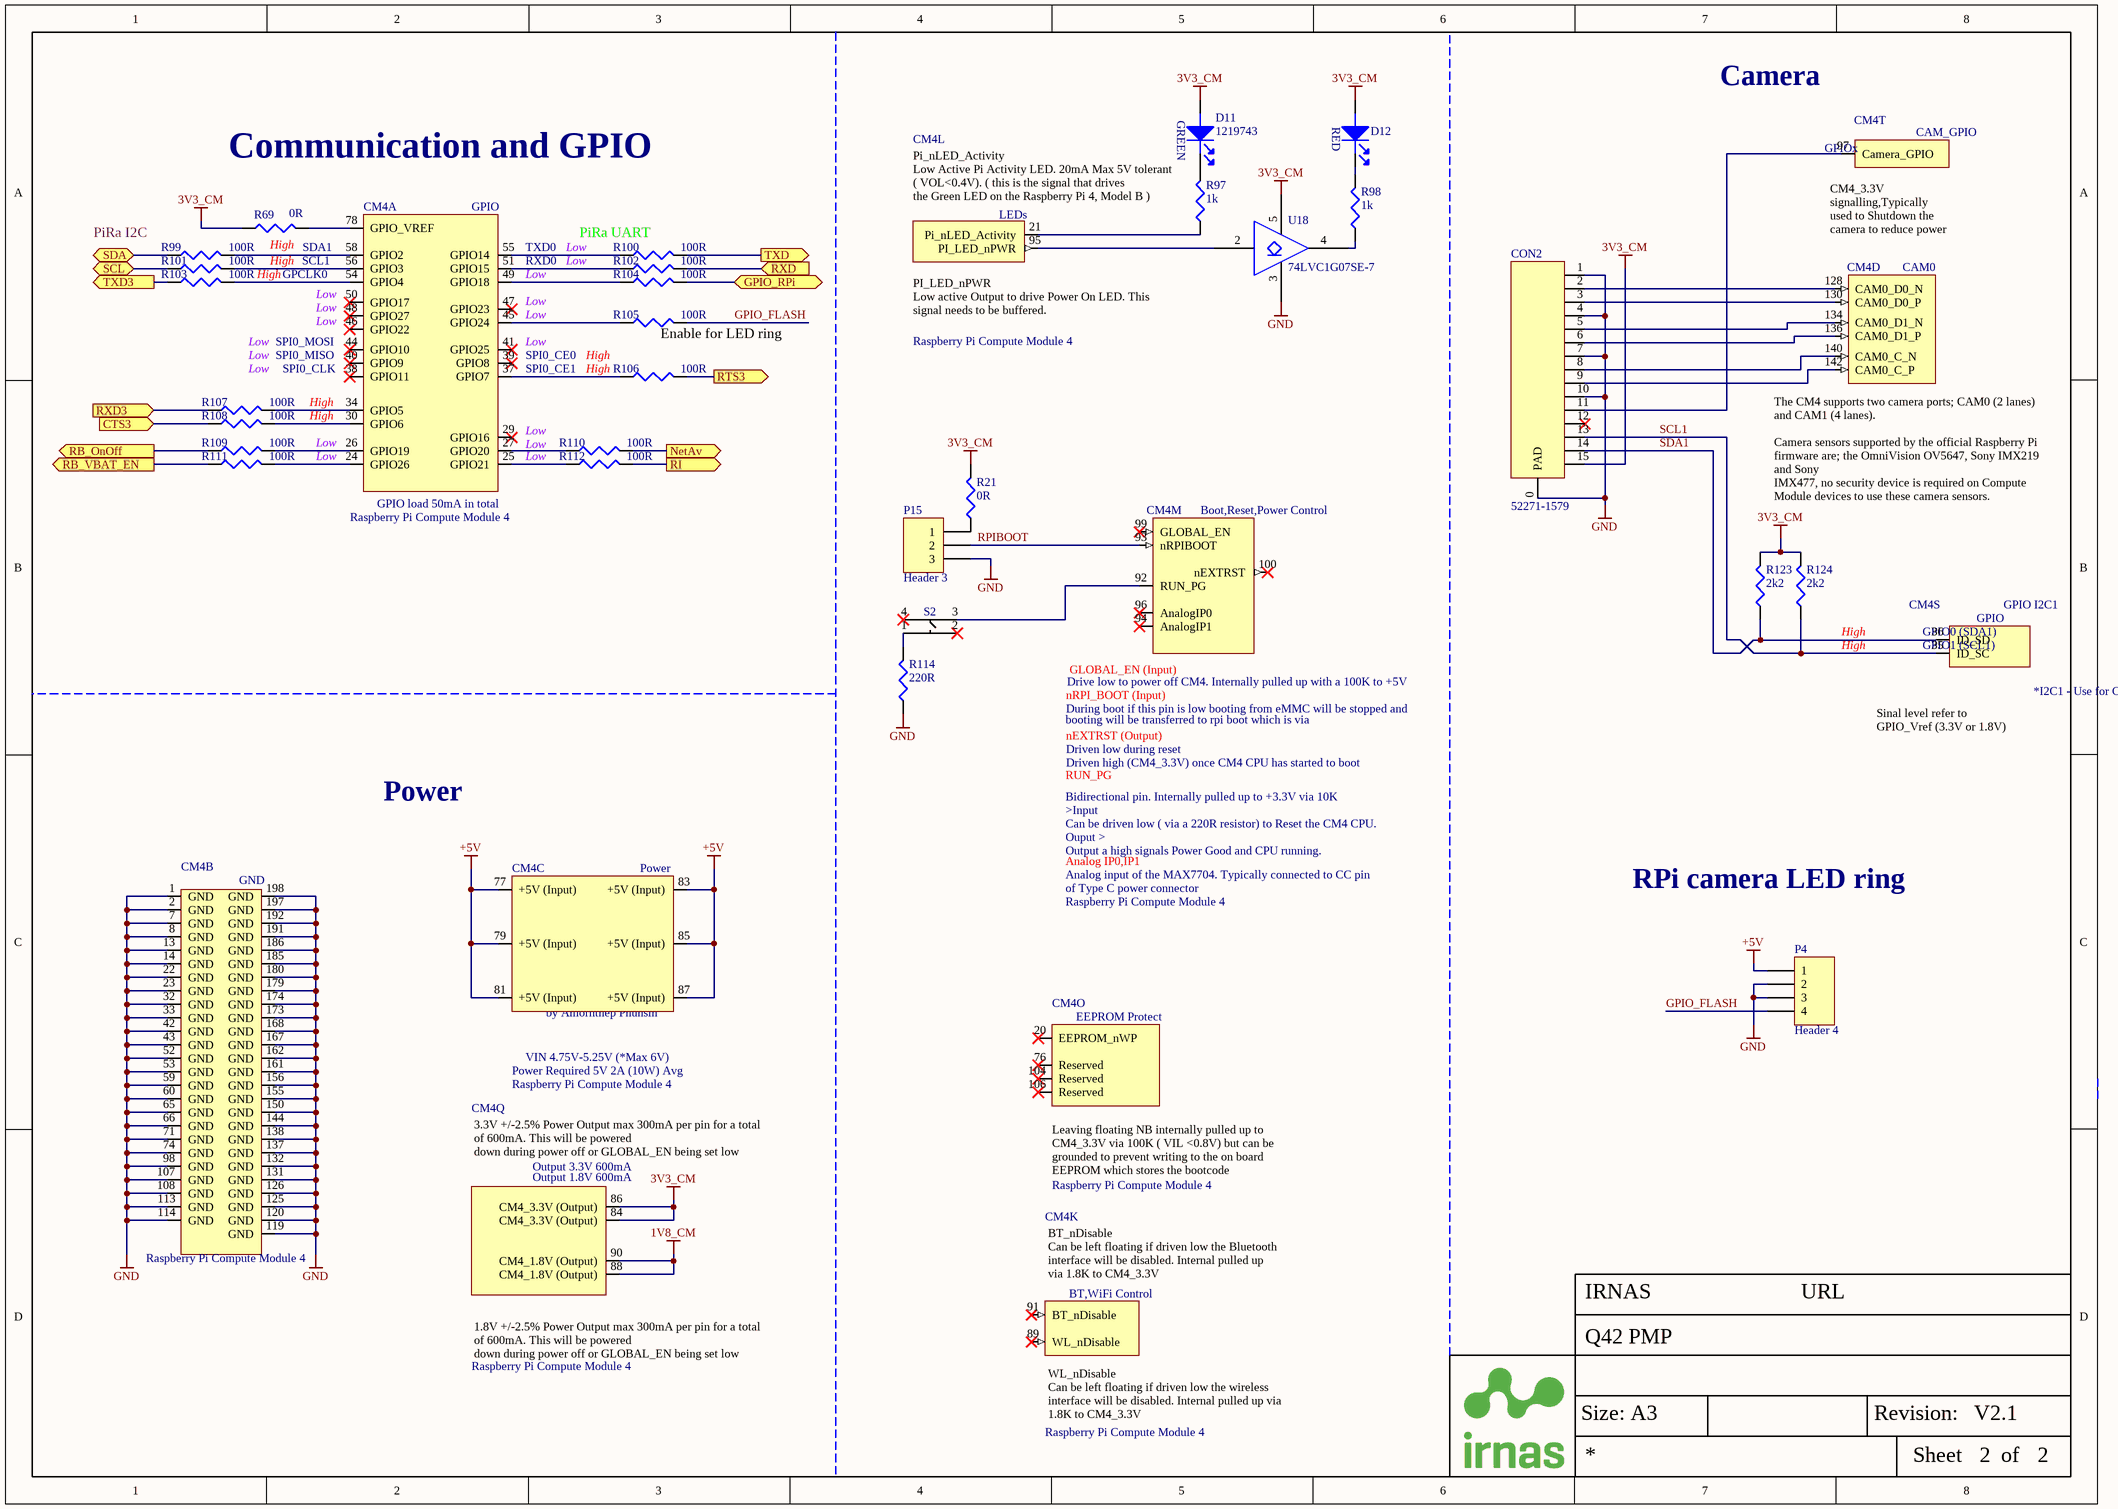
[diagram p8: RASPBERRY CM4.SchDoc]

### Parts
CM4  Raspberry Pi Compute Module 4  [Raspberry pi CM4]  (parts A,B,C,D,K,L,M,O,Q,S,T of 21)
CON2  52271-1579  [52271-1579]
D11  Supplier Part Number 1: 1219743  [LED0603]  (hidden comment: LED GREEN)
D12  LED RED  [LED0603]  (value not drawn)
P4  Header 4  [HDR1X4]
P15  Header 3  [HDR1X3]
R21  0R  [RES0603]
R69  0R  [RES0603]
R97  1k  [RES0603]
R98  1k  [RES0603]
R99  100R  [RES0603]
R100  100R  [RES0603]
R101  100R  [RES0603]
R102  100R  [RES0603]
R103  100R  [RES0603]
R104  100R  [RES0603]
R105  100R  [RES0603]
R106  100R  [RES0603]
R107  100R  [RES0603]
R108  100R  [RES0603]
R109  100R  [RES0603]
R110  100R  [RES0603]
R111  100R  [RES0603]
R112  100R  [RES0603]
R114  220R  [RES0603]
R123  2k2  [RES0603]
R124  2k2  [RES0603]
S2  BTN - KMR221NGLFS  [SW]  (value not drawn)
U18  74LVC1G07SE-7  [SOT-353]

### Ports
CTS3 (in), GPIO_RPi (bidir), NetAv (out), RB_OnOff (out), RB_VBAT_EN (out), RI (out), RTS3 (out), RXD3 (in), RXD (in), SCL (bidir), SDA (bidir), TXD3 (out), TXD (out)

### Nets
1V8_CM: CM4.88(CM4_1.8V_(Output)) CM4.90(CM4_1.8V_(Output))
3V3_CM: CM4.84(CM4_3.3V_(Output)) CM4.86(CM4_3.3V_(Output)) CON2.15 D11.2(ANODE) D12.2(ANODE) R21.2 R69.1 R123.2 R124.2 U18.5(VCC)
+5V: CM4.77(+5V_(Input)) CM4.79(+5V_(Input)) CM4.81(+5V_(Input)) CM4.83(+5V_(Input)) CM4.85(+5V_(Input)) CM4.87(+5V_(Input)) P4.1
GND: CM4.1(GND) CM4.2(GND) CM4.7(GND) CM4.8(GND) CM4.13(GND) CM4.14(GND) CM4.22(GND) CM4.23(GND) CM4.32(GND) CM4.33(GND) CM4.42(GND) CM4.43(GND) CM4.52(GND) CM4.53(GND) CM4.59(GND) CM4.60(GND) CM4.65(GND) CM4.66(GND) CM4.71(GND) CM4.74(GND) CM4.98(GND) CM4.107(GND) CM4.108(GND) CM4.113(GND) CM4.114(GND) CM4.119(GND) CM4.120(GND) CM4.125(GND) CM4.126(GND) CM4.131(GND) CM4.132(GND) CM4.137(GND) CM4.138(GND) CM4.144(GND) CM4.150(GND) CM4.155(GND) CM4.156(GND) CM4.161(GND) CM4.162(GND) CM4.167(GND) CM4.168(GND) CM4.173(GND) CM4.174(GND) CM4.179(GND) CM4.180(GND) CM4.185(GND) CM4.186(GND) CM4.191(GND) CM4.192(GND) CM4.197(GND) CM4.198(GND) CON2.0(PAD) CON2.1 CON2.4 CON2.7 CON2.10 P4.2 P4.3 P15.3 R114.1 U18.3(GND)
CTS3: R108.1 ; port CTS3
GPIO_FLASH: P4.4 R105.2
GPIO_RPi: R104.2 ; port GPIO_RPi
NetAv: R110.2 ; port NetAv
RB_OnOff: R109.1 ; port RB_OnOff
RB_VBAT_EN: R111.1 ; port RB_VBAT_EN
RI: R112.2 ; port RI
RPIBOOT: CM4.93(nRPIBOOT) P15.2
RTS3: R106.2 ; port RTS3
RXD3: R107.1 ; port RXD3
RXD_CM4: R102.2 ; port RXD
SCL: R101.1 ; port SCL
SCL1: CM4.35(ID_SC) CON2.13 R124.1
SDA: R99.1 ; port SDA
SDA1: CM4.36(ID_SD) CON2.14 R123.1
TXD3: R103.1 ; port TXD3
TXD_CM4: R100.2 ; port TXD
NetCM4_21: CM4.21(Pi_nLED_Activity) R97.1
NetCM4_24: CM4.24(GPIO26) R111.2
NetCM4_25: CM4.25(GPIO21) R112.1
NetCM4_26: CM4.26(GPIO19) R109.2
NetCM4_27: CM4.27(GPIO20) R110.1
NetCM4_30: CM4.30(GPIO6) R108.2
NetCM4_34: CM4.34(GPIO5) R107.2
NetCM4_37: CM4.37(GPIO7) R106.1
NetCM4_45: CM4.45(GPIO24) R105.1
NetCM4_49: CM4.49(GPIO18) R104.1
NetCM4_51: CM4.51(GPIO15) R102.1
NetCM4_54: CM4.54(GPIO4) R103.2
NetCM4_55: CM4.55(GPIO14) R100.1
NetCM4_56: CM4.56(GPIO3) R101.2
NetCM4_58: CM4.58(GPIO2) R99.2
NetCM4_78: CM4.78(GPIO_VREF) R69.2
NetCM4_92: CM4.92(RUN_PG) S2.3
NetCM4_95: CM4.95(PI_LED_nPWR) U18.2
NetCM4_97: CM4.97(Camera_GPIO) CON2.11
NetCM4_128: CM4.128(CAM0_D0_N) CON2.2
NetCM4_130: CM4.130(CAM0_D0_P) CON2.3
NetCM4_134: CM4.134(CAM0_D1_N) CON2.5
NetCM4_136: CM4.136(CAM0_D1_P) CON2.6
NetCM4_140: CM4.140(CAM0_C_N) CON2.8
NetCM4_142: CM4.142(CAM0_C_P) CON2.9
NetD11_1: D11.1(cathode) R97.2
NetD12_1: D12.1(cathode) R98.2
NetP15_1: P15.1 R21.1
NetR98_1: R98.1 U18.4
NetR114_2: R114.2 S2.1

Not connected (* = marked no-connect by the designer): CM4 20(EEPROM_nWP)* 29(GPIO16)* 38(GPIO11)* 39(GPIO8)* 40(GPIO9)* 41(GPIO25)* 44(GPIO10)* 46(GPIO22)* 47(GPIO23)* 48(GPIO27)* 50(GPIO17)* 76(Reserved)* 89(WL_nDisable)* 91(BT_nDisable)* 94(AnalogIP1)* 96(AnalogIP0)* 99(GLOBAL_EN)* 100(nEXTRST)* 104(Reserved)* 106(Reserved)*; CON2 12*; S2 2* 4*

### Notes on the sheet
- Camera
- Communication and GPIO
- PiRa I2C
- (near R100) PiRa UART
- (near R105) Enable for LED ring
- Power
- RPi camera LED ring
- Size: A3
- Revision:
- Sheet
- of
- (in symbol CM4, part A) GPIO; High; SDA1; TXD0; Low; SCL1; RXD0; GPCLK0; SPI0_MOSI; SPI0_MISO; SPI0_CE0; SPI0_CLK; SPI0_CE1; by Amornthep Phunsin; GPIO load 50mA in total
- (in symbol CM4, part C) Power; by Amornthep Phunsin; VIN 4.75V-5.25V (*Max 6V); Power Required 5V 2A (10W) Avg
- (in symbol CM4, part D) CAM0; The CM4 supports two camera ports; CAM0 (2 lanes) and CAM1 (4 lanes). / Camera sensors supported by the official Raspberry Pi firmware are; the OmniVision OV5647, Sony IMX219 and Sony / IMX477, no security device is required on Compute Module devices to use these camera sensors.
- (in symbol CM4, part K) BT_nDisable / Can be left floating if driven low the Bluetooth interface will be disabled. Internal pulled up / via 1.8K to CM4_3.3V; BT,WiFi Control; WL_nDisable / Can be left floating if driven low the wireless interface will be disabled. Internal pulled up via / 1.8K to CM4_3.3V
- (in symbol CM4, part L) Pi_nLED_Activity / Low Active Pi Activity LED. 20mA Max 5V tolerant ( VOL<0.4V). ( this is the signal that drives / the Green LED on the Raspberry Pi 4, Model B ); LEDs; PI_LED_nPWR / Low active Output to drive Power On LED. This signal needs to be buffered.
- (in symbol CM4, part M) Boot,Reset,Power Control; GLOBAL_EN (Input); Drive low to power off CM4. Internally pulled up with a 100K to +5V; nRPI_BOOT (Input); During boot if this pin is low booting from eMMC will be stopped and; booting will be transferred to rpi boot which is via; nEXTRST (Output); Driven low during reset; Driven high (CM4_3.3V) once CM4 CPU has started to boot; Bidirectional pin. Internally pulled up to +3.3V via 10K / >Input / Can be driven low ( via a 220R resistor) to Reset the CM4 CPU. / Ouput > / Output a high signals Power Good and CPU running.; Analog IP0,IP1; Analog input of the MAX7704. Typically connected to CC pin; of Type C power connector
- (in symbol CM4, part O) EEPROM Protect; Leaving floating NB internally pulled up to CM4_3.3V via 100K ( VIL <0.8V) but can be / grounded to prevent writing to the on board EEPROM which stores the bootcode
- (in symbol CM4, part Q) 3.3V +/-2.5% Power Output max 300mA per pin for a total of 600mA. This will be powered / down during power off or GLOBAL_EN being set low; Output 3.3V 600mA; Output 1.8V 600mA; 1.8V +/-2.5% Power Output max 300mA per pin for a total of 600mA. This will be powered / down during power off or GLOBAL_EN being set low
- (in symbol CM4, part S) GPIO I2C1; GPIO; High; GPIO0 (SDA1); GPIO1 (SCL1); *I2C1 - Use for CAM0,DSI0,GPIO,EEPROM HAT; Sinal level refer to  GPIO_Vref (3.3V or 1.8V)
- (in symbol CM4, part T) CAM_GPIO; GPIOx; CM4_3.3V signalling,Typically used to Shutdown the camera to reduce power
- (in symbol LED - LED GREEN) GREEN
- (in symbol LED - LED RED) RED

### Library data of the parts
CM4 = CM4: as CM4 on sheet USB SWITCH; Supplier 1: Farnell; Supplier Part Number 1: 3493346
CON2 = 52271-1579: FFC / FPC Board Connector, 1 mm, 15 Contacts, Receptacle, Easy-On 52271 Series, Surface Mount; Supplier 1: Farnell; Supplier Part Number 1: 3215778; ComponentLink1Description: Datasheet; ComponentLink1URL: http://www.farnell.com/datasheets/2791605.pdf
D11 = LED - LED GREEN: as D7 on sheet PIRA BLE, LORA, RTC; RoHS: YES; Stock 1: 7534; Pricing 1: 1=0.361, 10=0.256, 50=0.235, 100=0.106, 200=0.101 (GBP); LED Mounting: SMD; Bulb Size: -; Packaging: Cut Tape; Product Range: -; Automotive Qualification Standard: -; MSL: -; ComponentLink3URL: http://www.farnell.com/datasheets/2095939.pdf?_ga=2.85835929.1644194861.1561957338-1373726713.1554121096; ComponentLink3Description: Datasheet; Supplier 1: Farnell
D12 = LED - LED RED: BROADCOM LIMITED - HSMS-C190 - LED, RED, 10MCD, 626NM; LED Mounting: SMD; Forward Current If: 20; Forward Voltage: 2.1; Wavelength Typ: 626; Luminous Intensity: 10; Viewing Angle: 170°; Lens Shape: Rectangular; SVHC: No SVHC (17-Dec-2015)<!--FANDB--><div class="features-and-benefits-container"><div class="features-and-benefits-description"><span class="features-benefits-value">The HSMS-C190 is a HER SMD Chip LED with untinted/diffused lens, made of GaP. It is designed in an industry standard package 1.6 x 0.8mm footprint with 0.8mm profile. It is compatible with IR reflow solder processes. The small size and wide viewing angle make this LED prime choices for backlighting applications and front panel illumination especially where space is a premium.</span></div><div class="features-and-benefits-list"><ul class="features-and-benefits-list-list"><li class="features-and-benefits-list-item">Small size</li><li class="features-and-benefits-list-item">Industry standard footprint</li><li class="features-and-benefits-list-item">Compatible with IR solder</li><li class="features-and-benefits-list-item">Diffused optics</li><li class="features-and-benefits-list-item">-40 to 85; Supplier 1: Farnell; Manufacturer: BROADCOM LIMITED; Manufacturer Part Number: HSMS-C190; RoHS: YES; Stock 1: 7534; Pricing 1: 1=0.361, 10=0.256, 50=0.235, 100=0.106, 200=0.101 (GBP); LED Colour: Red; Bulb Size: -; Packaging: Cut Tape; Product Range: -; Automotive Qualification Standard: -; MSL: -; ComponentLink1URL: http://www.farnell.com/datasheets/313031.pdf; ComponentLink1Description: http://www.farnell.com/datasheets/313031.pdf; ComponentLink2URL: http://www.farnell.com/datasheets/1681524.pdf; ComponentLink2Description: http://www.farnell.com/datasheets/1681524.pdf; ComponentLink3URL: http://www.farnell.com/datasheets/2165483.pdf; ComponentLink3Description: http://www.farnell.com/datasheets/2165483.pdf; Supplier Part Number 1: 2497356
P4 = Header 4: Header, 4-Pin; LatestRevisionDate: 17-Jul-2002; LatestRevisionNote: Re-released for DXP Platform.; Publisher: Altium Limited; Supplier Part Number 1: Header 2.54 mm
P15 = Header 3: Header, 3-Pin; LatestRevisionDate: 17-Jul-2002; LatestRevisionNote: Re-released for DXP Platform.; Publisher: Altium Limited
R21 R69 = R - 0R: as R117 on sheet USB SWITCH; Supplier 1: Farnell; Manufacturer: BOURNS; Manufacturer Part Number: CR0603-J/-000ELF; RoHS: YES; Stock 1: 58200; Pricing 1: 10=0.0146, 250=0.0097, 1000=0.0073, 5000=0.0049, 12500=0.0042 (GBP); Resistance Tolerance: ± 5%; Packaging: Cut Tape; Resistor Element Material: Thick Film; Temperature Coefficient: -; Automotive Qualification Standard: -; MSL: MSL 1 - Unlimited; ComponentLink1URL: http://www.bourns.com/engineering/CHPREZTR/cr0603.stp; ComponentLink1Description: http://www.bourns.com/engineering/CHPREZTR/cr0603.stp; ComponentLink2URL: http://www.farnell.com/datasheets/2178762.pdf; ComponentLink2Description: http://www.farnell.com/datasheets/2178762.pdf; Supplier Part Number 1: 2008343
R97 R98 = R - 1k: as R16 on sheet PIRA BLE, LORA, RTC; Supplier 1: Farnell; Manufacturer: MULTICOMP; Manufacturer Part Number: MCMR06X102 JTL; RoHS: Y-EX; Stock 1: 18133; Pricing 1: 10=0.0089, 100=0.0076, 500=0.0063, 1000=0.0049, 2500=0.0033, 5000=0.0024, 25000=0.0016, 50000=0.0013 (GBP); Resistance Tolerance: ± 5%; Packaging: Cut Tape; Resistor Element Material: Ceramic; Automotive Qualification Standard: -; ComponentLink1URL: http://www.farnell.com/datasheets/1716707.pdf; ComponentLink1Description: http://www.farnell.com/datasheets/1716707.pdf; Supplier Part Number 1: 2073354
R99-R112 = R - 100R: as R25 on sheet PIRA BLE, LORA, RTC; Supplier 1: Farnell; Manufacturer: MULTICOMP; Manufacturer Part Number: MC0063W06031100R; RoHS: Y-EX; Stock 1: 78152; Pricing 1: 10=0.0011, 100=0.001, 500=0.0009, 1000=0.0008, 2500=0.0007 (GBP); Resistance Tolerance: ± 1%; Packaging: Cut Tape; Resistor Element Material: Thick Film; Automotive Qualification Standard: -; Operating Temperature Max: 155; Operating Temperature Min: -55; Operating Temperature Range: -55°C to +155; Tape Width: 8; Temperature Coeff. -: 200; Tolerance +: 1%; Tolerance -: 1%; ComponentLink1URL: http://www.farnell.com/datasheets/1788326.pdf; ComponentLink1Description: http://www.farnell.com/datasheets/1788326.pdf; ComponentLink2URL: http://www.farnell.com/cad/1561149.zip; ComponentLink2Description: http://www.farnell.com/cad/1561149.zip; ComponentLink3URL: http://www.farnell.com/datasheets/2289252.pdf; ComponentLink3Description: http://www.farnell.com/datasheets/2289252.pdf; Supplier Part Number 1: 9330364
R114 = R - 220R: MULTICOMP - MCWR06X2200FTL - RES, THICK FILM, 220R, 1%, 0.1W, 0603; IRNAS Part No.: I-100022; Resistance: 220; Voltage Rating: 50; Resistor Case Style: 0603 [1608 Metric]; Power Rating: 100; Product Range: MCWR Series; Temperature Coefficient: ± 100; SVHC: No SVHC (07-Jul-2017)<!--FANDB--><div class="features-and-benefits-container"><div class="features-and-benefits-desc-container"><span class="features-and-benefits-container-desc">SMD Chip Resistor, Thick Film, 220 ohm, 50 V, 0603 [1608 Metric], 100 mW, ± 1; Supplier 1: Farnell; Manufacturer: MULTICOMP; Manufacturer Part Number: MCWR06X2200FTL; RoHS: Y-EX; Stock 1: 124834; Pricing 1: 10=0.0031, 100=0.0018, 500=0.0013, 1000=0.001, 2500=0.0008 (GBP); Resistance Tolerance: ± 1%; Packaging: Cut Tape; Resistor Element Material: Thick Film; Automotive Qualification Standard: -; ComponentLink1URL: http://www.farnell.com/datasheets/1849611.pdf; ComponentLink1Description: http://www.farnell.com/datasheets/1849611.pdf; Supplier Part Number 1: 2447298
R123 R124 = R - 2k2: as R36 on sheet PIRA BLE, LORA, RTC; Supplier 1: Farnell; Manufacturer: MULTICOMP; Manufacturer Part Number: MCMR06X2201FTL; RoHS: Y-EX; Stock 1: 17638; Pricing 1: 10=0.0099, 100=0.0059, 500=0.0042, 1000=0.0033, 2500=0.0027 (GBP); ComponentLink1URL: http://www.farnell.com/datasheets/1716707.pdf; ComponentLink1Description: http://www.farnell.com/datasheets/1716707.pdf; Supplier Part Number 1: 2073429
S2 = BTN - KMR221NGLFS: SWITCH TACTILE SPST-NO 0.05A 32V; Manufacturer: ITT C&K; Mechanical Life: 200000Cycles; Throw Configuration: SPST; Operating Force: 2N; Max Current Rating: 50mA; Power Rating: 1W; Illumination Type: Non-Illuminated; Switch Travel: 0.25mm; Switch Function: Off-Mom; Actuator Type: Standard; Actuator Length: 0.5mm; Supplier 1: Farnell; Manufacturer Part Number: KMR221NGLFS; Stock 1: 3038; Pricing 1: 10 = 0.29100, 500 = 0.27600, 1000 = 0.21800, 5000 = 0.18500, 10000 = 0.18100 (GBP); RoHS: Yes; Mount: Surface Mount; Case/Package: SMD/SMT; Contact Material: Silver; Contact Plating: Silver; Min Operating Temperature: -40°C; Max Operating Temperature: 85°C; Voltage Rating (DC): 32V; Packaging: Tape and Reel; Package Quantity: 1; Max Voltage Rating (DC): 32V; Current Rating: 50mA; Termination: Gull Wing; Orientation: Straight; Length: 2.8mm; Depth: 4.6mm; Radiation Hardening: No; Lead Free: Lead Free; ComponentLink1URL: https://www.ckswitches.com/media/1479/kmr2.pdf?src-supplier=Digi-Key; ComponentLink1Description: https://www.ckswitches.com/media/1479/kmr2.pdf?src-supplier=Digi-Key; ComponentLink2URL: http://www.ck-components.com/14414/kmr2_9aug12.pdf/?src-supplier=Avnet+Europe; ComponentLink2Description: http://www.ck-components.com/14414/kmr2_9aug12.pdf/?src-supplier=Avnet+Europe; ComponentLink3URL: http://www1.futureelectronics.com/doc/C%20-%20K%20COMPONENTS/KMR221NGLFS.pdf?src-supplier=Future+Electronics; ComponentLink3Description: http://www1.futureelectronics.com/doc/C%20-%20K%20COMPONENTS/KMR221NGLFS.pdf?src-supplier=Future+Electronics; Supplier Part Number 1: 2845727
U18 = D - 74LVC1G07SE-7: Buffer, 74LVC1G07, 1.65 V to 5.5 V, SOT-353-5; Supplier 1: Farnell; Supplier Part Number 1: 1845213; Datasheet: http://www.farnell.com/datasheets/2238488.pdf

## Nets that join several sheets
+3V3: SENSORS (11 pins), PIRA POWER (C14.1 U3.2 U3.6), PIRA BLE, LORA, RTC (16 pins), USB SWITCH (C25.1 R61.1 U22.1), CONNECTIVITY (R72.2 R73.2 R74.2 U17.2), IFREMER ADD ON (9 pins)
+5V: PIRA POWER (6 pins), PIRA BLE, LORA, RTC (P2.1), USB SWITCH (C28.1 CON8.1 D8.5), CONNECTIVITY (R115.1), IFREMER ADD ON (P13.1 P14.1), RASPBERRY CM4 (7 pins)
+VBAT: BATTERY PACK (U9.2 U10.2 U11.2), PIRA POWER (F1.2 P1.1), CONNECTIVITY (U21.5)
GND: MAIN (5 pins), BATTERY PACK (7 pins), SENSORS (27 pins), PIRA POWER (36 pins), PIRA BLE, LORA, RTC (30 pins), USB SWITCH (15 pins), CONNECTIVITY (24 pins), IFREMER ADD ON (24 pins), RASPBERRY CM4 (61 pins)
VBAT: PIRA POWER (13 pins), PIRA BLE, LORA, RTC (R29.2)
VUSB: PIRA POWER (6 pins), USB SWITCH (6 pins)
ACCEL_INT: PIRA BLE, LORA, RTC (U6.20), IFREMER ADD ON (U20.12)
BUSY: PIRA BLE, LORA, RTC (U6.38), CONNECTIVITY (R79.2)
CTS3: CONNECTIVITY (R116.1 R118.1), RASPBERRY CM4 (R108.1)
DIO1: PIRA BLE, LORA, RTC (U6.45), CONNECTIVITY (R80.2)
DRIVER_EN: PIRA BLE, LORA, RTC (U6.23), IFREMER ADD ON (R90.2)
ENABLE_5V: PIRA POWER (U2.14), PIRA BLE, LORA, RTC (U6.39)
GPIO_PA0: SENSORS (R39.2), PIRA BLE, LORA, RTC (U6.33)
GPIO_PB5: SENSORS (R50.2), PIRA BLE, LORA, RTC (P2.5 U6.40)
GPIO_PH0: PIRA BLE, LORA, RTC (P2.3 R16.2 U6.46), CONNECTIVITY (R70.2)
GPIO_RPi: PIRA BLE, LORA, RTC (U6.2), RASPBERRY CM4 (R104.2)
GPS_RX: MAIN (R35.2 R86.2), SENSORS (U12.14), IFREMER ADD ON (R93.2 U19.4)
GPS_TX: MAIN (R34.2 R59.1), SENSORS (U12.13), IFREMER ADD ON (U19.1)
LORA_ANT: MAIN (J2.1), PIRA BLE, LORA, RTC (U6.26)
NetAv: CONNECTIVITY (CON6.7), RASPBERRY CM4 (R110.2)
RB_OnOff: CONNECTIVITY (CON6.4), RASPBERRY CM4 (R109.1)
RB_VBAT_EN: CONNECTIVITY (R128.1), RASPBERRY CM4 (R111.1)
RI: CONNECTIVITY (CON6.6), RASPBERRY CM4 (R112.2)
RTS3: CONNECTIVITY (R119.2 R120.1), RASPBERRY CM4 (R106.2)
RXD: MAIN (R17.1 R18.1), PIRA BLE, LORA, RTC (U6.18)
RXD3: CONNECTIVITY (R81.1 R82.1), RASPBERRY CM4 (R107.1)
RXD_CM4: MAIN (R17.2 R19.1), RASPBERRY CM4 (R102.2)
RXEN: PIRA BLE, LORA, RTC (U6.37), CONNECTIVITY (R75.2)
SCL: SENSORS (TP3.0 U7.3 U13.4), PIRA POWER (U1.5), PIRA BLE, LORA, RTC (P8.2 R11.1 U5.6 U6.35), IFREMER ADD ON (U20.23), RASPBERRY CM4 (R101.1)
SDA: SENSORS (TP5.0 U7.9 U13.3), PIRA POWER (U1.6), PIRA BLE, LORA, RTC (P8.3 R6.1 U5.5 U6.36), IFREMER ADD ON (U20.24), RASPBERRY CM4 (R99.1)
SPI_MISO: PIRA BLE, LORA, RTC (U6.15), CONNECTIVITY (U16.16)
SPI_MOSI: PIRA BLE, LORA, RTC (U6.14), CONNECTIVITY (U16.17)
SPI_NSS: PIRA BLE, LORA, RTC (U6.17), CONNECTIVITY (U16.19)
SPI_SCK: PIRA BLE, LORA, RTC (U6.16), CONNECTIVITY (U16.18)
TXD: MAIN (R19.2 R20.1), PIRA BLE, LORA, RTC (U6.19)
TXD3: CONNECTIVITY (R83.2 R84.1), RASPBERRY CM4 (R103.1)
TXD_CM4: MAIN (R18.2 R20.2), RASPBERRY CM4 (R100.2)
UART1_RX: MAIN (R34.1 R35.1), PIRA BLE, LORA, RTC (P2.10 R28.2)
UART1_TX: MAIN (R59.2 R86.1), PIRA BLE, LORA, RTC (P2.9 R25.2)
V_SOLAR: BATTERY PACK (CON7.1 P7.1), PIRA POWER (D3.2 P3.2)

## Assembly variants
BASIC: not fitted C16 L3 L4 R17 R20 R30 R34 R38 R39 R42 R43 R44 R46 R47 R49 R53 R64 R65 R72 R82 R83 R86 R88 R99 R101 R118 R119
Q42: not fitted C16 C22 C24 C27 C36 C43 C44 C45 CON1 CON2 CON3 CON5 D10 L3 L4 L6 P2 P4 P7 P8 P13 P14 R17 R20 R34 R39 R40 R41 R42 R43 R44 R45 R46 R47 R48 R49 R50 R51 R52 R53 R54 R55 R58 R60 R64 R72 R82 R83 R85 R86 R89 R90 R91 R92 R93 R94 R95 R96 R99 R101 R118 R119 R121 R122 R123 R124 R125 T2 U4 U7 U8 U12 U15 U19 U20